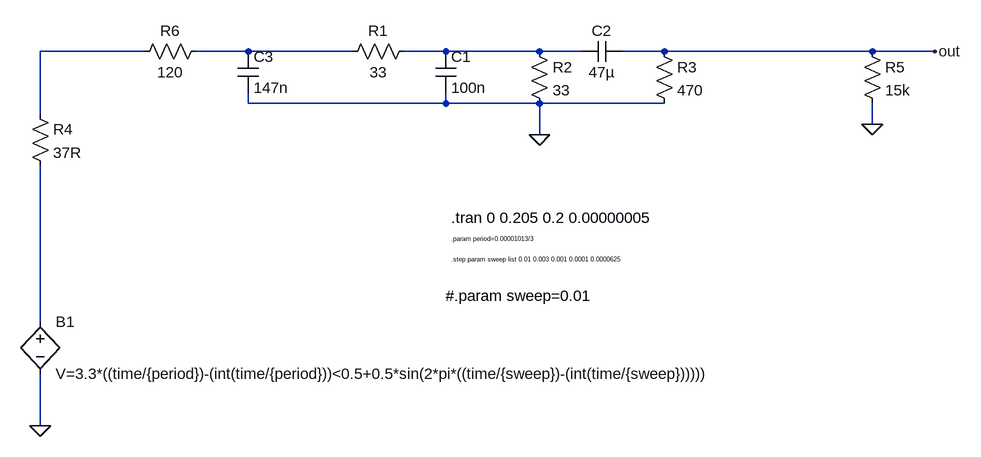
[diagram p0: schematic LineOutPWM.asc]
LineOutPWM.asc, the LTspice schematic file:
Version 4
SHEET 1 6680 708
WIRE -384 112 -544 112
WIRE -224 112 -304 112
WIRE -64 112 -224 112
WIRE 80 112 16 112
WIRE 224 112 80 112
WIRE 288 112 224 112
WIRE 416 112 352 112
WIRE 736 112 416 112
WIRE 832 112 736 112
WIRE -224 192 -224 176
WIRE 80 192 80 176
WIRE 80 192 -224 192
WIRE 224 192 80 192
WIRE 416 192 224 192
WIRE -544 208 -544 112
WIRE 736 224 736 192
WIRE 224 240 224 192
WIRE -544 528 -544 288
WIRE -544 688 -544 608
FLAG 832 112 out
FLAG 224 240 0
FLAG -544 688 0
FLAG 736 224 0
SYMBOL res 32 96 R90
WINDOW 0 0 56 VBottom 2
WINDOW 3 32 56 VTop 2
SYMATTR InstName R1
SYMATTR Value 33
SYMBOL res 400 96 R0
SYMATTR InstName R3
SYMATTR Value 470
SYMBOL cap 64 112 R0
SYMATTR InstName C1
SYMATTR Value 100n
SYMBOL cap 288 128 R270
WINDOW 0 32 32 VTop 2
WINDOW 3 0 32 VBottom 2
SYMATTR InstName C2
SYMATTR Value 47µ
SYMBOL bv -544 512 R0
SYMATTR InstName B1
SYMATTR Value V=3.3*((time/{period})-(int(time/{period}))<0.5+0.5*sin(2*pi*((time/{sweep})-(int(time/{sweep})))))
SYMBOL res -560 192 R0
SYMATTR InstName R4
SYMATTR Value 37R
SYMBOL res 720 96 R0
SYMATTR InstName R5
SYMATTR Value 15k
SYMBOL res -288 96 R90
WINDOW 0 0 56 VBottom 2
WINDOW 3 32 56 VTop 2
SYMATTR InstName R6
SYMATTR Value 120
SYMBOL cap -240 112 R0
SYMATTR InstName C3
SYMATTR Value 147n
SYMBOL res 208 96 R0
SYMATTR InstName R2
SYMATTR Value 33
TEXT 88 368 Left 2 !.tran 0 0.205 0.2 0.00000005
TEXT 88 400 Left 0 !.param period=0.00001013/3
TEXT 88 432 Left 0 !.step param sweep list 0.01 0.003 0.001 0.0001 0.0000625
TEXT 80 488 Left 2 !#.param sweep=0.01

The netlist it stands for:
* LineOutPWM.asc
R1 N003 N002 33
R3 out 0 470
C1 N003 0 100n
C2 N003 out 47µ
B1 N004 0 V=3.3*((time/{period})-(int(time/{period}))<0.5+0.5*sin(2*pi*((time/{sweep})-(int(time/{sweep})))))
R4 N001 N004 37R
R5 out 0 15k
R6 N002 N001 120
C3 N002 0 147n
R2 N003 0 33
.tran 0 0.205 0.2 0.00000005
.param period=0.00001013/3
.step param sweep list 0.01 0.003 0.001 0.0001 0.0000625
#.param sweep=0.01
.backanno
.end